# EAGLE design pbalduino (EAGLE 8.3.2)
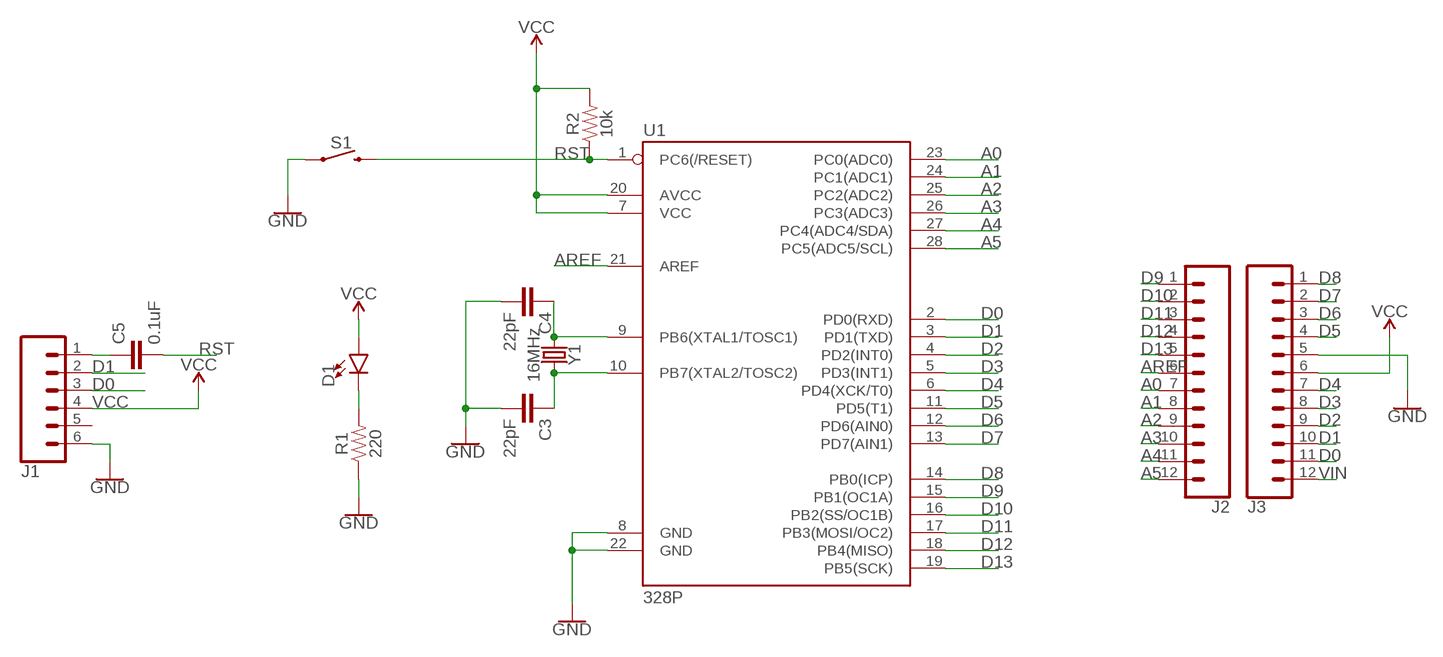
[diagram p0: schematic, sheet 1]

## Parts
C3  22pF  22PF-PTH-2.54MM-200V-5%  [CAP-PTH-2.54]
C4  22pF  22PF-PTH-2.54MM-200V-5%  [CAP-PTH-2.54]
C5  0.1uF  0.1UF-KIT-EZ-50V-20%  [CAP-PTH-SMALL-KIT]
D1  LED-3MM-NO_SILK  [LED_3MM-NS]
J1  CONN_06LOCK  [1X06_LOCK]
J2  CONN_12  [1X12]
J3  CONN_12  [1X12]
R1  220  1KOHM-VERT-1/4W-5%  [AXIAL-0.1]
R2  10k  1KOHM-VERT-1/4W-5%  [AXIAL-0.1]
S1  MOMENTARY-SWITCH-SPST-PTH-6.0MM  [TACTILE_SWITCH_PTH_6.0MM]
U1  328P  ATMEGA328P_PDIP  [DIP28]
Y1  16MHz  CRYSTAL-16MHZPTH-HC49US  [HC49US]

## Nets
A0: J2.7 U1.23(PC0(ADC0))
A1: J2.8 U1.24(PC1(ADC1))
A2: J2.9 U1.25(PC2(ADC2))
A3: J2.10 U1.26(PC3(ADC3))
A4: J2.11 U1.27(PC4(ADC4/SDA))
A5: J2.12 U1.28(PC5(ADC5/SCL))
AREF: J2.6 U1.21(AREF)
D0: J1.3 J3.11 U1.2(PD0(RXD))
D1: J1.2 J3.10 U1.3(PD1(TXD))
D2: J3.9 U1.4(PD2(INT0))
D3: J3.8 U1.5(PD3(INT1))
D4: J3.7 U1.6(PD4(XCK/T0))
D5: J3.4 U1.11(PD5(T1))
D6: J3.3 U1.12(PD6(AIN0))
D7: J3.2 U1.13(PD7(AIN1))
D8: J3.1 U1.14(PB0(ICP))
D9: J2.1 U1.15(PB1(OC1A))
D10: J2.2 U1.16(PB2(SS/OC1B))
D11: J2.3 U1.17(PB3(MOSI/OC2))
D12: J2.4 U1.18(PB4(MISO))
D13: J2.5 U1.19(PB5(SCK))
GND: C3.2 C4.2 J1.6 J3.5 R1.P$1 S1.1 U1.8(GND) U1.22(GND)
N$1: C5.1 J1.1
N$21: C3.1 U1.10(PB7(XTAL2/TOSC2)) Y1.2
N$22: C4.1 U1.9(PB6(XTAL1/TOSC1)) Y1.1
N$28: D1.K(C) R1.P$2
RST: C5.2 R2.P$1 S1.3 U1.1(PC6(/RESET))
VCC: D1.A J1.4 J3.6 R2.P$2 U1.7(VCC) U1.20(AVCC)
VIN: J3.12
Unconnected: J1.5

## Library data of the parts
C3 C4 = SparkFun-Capacitors:22PF: 22pF ceramic capacitors A capacitor is a passive two-terminal electrical component used to store electrical energy temporarily in an electric field.; PROD_ID: CAP-09128
C5 = SparkFun-Capacitors:0.1UF: 0.1µF ceramic capacitors A capacitor is a passive two-terminal electrical component used to store electrical energy temporarily in an electric field.; PROD_ID: CAP-08370
D1 = SparkFun-LED:LED: LED (Generic) Standard schematic elements and footprints for 5mm, 3mm, 1206, and 0603 sized LEDs. Generic LEDs with no color specified.
J1 = SparkFun-Connectors:CONN_06: Multi connection point. Often used as Generic Header-pin footprint for 0.1 inch spaced/style header connections On any of the 0.1 inch spaced packages, you can populate with these: Break Away Headers - Straight <https://www.sparkfun.com/products/116> (PRT-00116) Break Away Male Headers - Right Angle <https://www.sparkfun.com/products/553> (PRT-00553) Female Headers <https://www.sparkfun.com/products/115> (PRT-00115) Break Away Headers - Machine Pin <https://www.sparkfun.com/products/117> (PRT-00117) Break Away Female Headers - Swiss Machine Pin <https://www.sparkfun.com/products/743> (PRT-00743) Arduino Stackable Header - 6 Pin <https://www.sparkfun.com/products/9280> (PRT-09280) For SCREWTERMINALS and SPRING TERMINALS visit here: Screw Terimnals on SparkFun.com <https://www.sparkfun.com/search/results?term=Screw+Terminals> (5mm/3.5mm/2.54mm spacing) This device is also useful as a general connection point to wire up your design to another part of your project. Our various solder wires solder well into these plated through hole pads. Hook-Up Wire - Assortment (Stranded, 22 AWG) <https://www.sparkfun.com/products/11375> (PRT-11375) Hook-Up Wire - Assortment (Solid Core, 22 AWG) <https://www.sparkfun.com/products/11367> (PRT-11367) View the entire wire category on our website here <https://www.sparkfun.com/categories/141>
J2 J3 = SparkFun-Connectors:CONN_12: Multi connection point. Often used as Generic Header-pin footprint for 0.1 inch spaced/style header connections On any of the 0.1 inch spaced packages, you can populate with these: Break Away Headers - Straight <https://www.sparkfun.com/products/116> (PRT-00116) Break Away Male Headers - Right Angle <https://www.sparkfun.com/products/553> (PRT-00553) Female Headers <https://www.sparkfun.com/products/115> (PRT-00115) Break Away Headers - Machine Pin <https://www.sparkfun.com/products/117> (PRT-00117) Break Away Female Headers - Swiss Machine Pin <https://www.sparkfun.com/products/743> (PRT-00743) For SCREWTERMINALS and SPRING TERMINALS visit here: Screw Terimnals on SparkFun.com <https://www.sparkfun.com/search/results?term=Screw+Terminals> (5mm/3.5mm/2.54mm spacing) This device is also useful as a general connection point to wire up your design to another part of your project. Our various solder wires solder well into these plated through hole pads. Hook-Up Wire - Assortment (Stranded, 22 AWG) <https://www.sparkfun.com/products/11375> (PRT-11375) Hook-Up Wire - Assortment (Solid Core, 22 AWG) <https://www.sparkfun.com/products/11367> (PRT-11367) View the entire wire category on our website here <https://www.sparkfun.com/categories/141> Special notes: Molex polarized connector foot print use with SKU : PRT-08231 with associated crimp pins and housings. 1MM SMD Version SKU: PRT-10208 NOTES ON THE VARIANTS LOCK and LOCK_LONGPADS... This footprint was designed to help hold the alignment of a through-hole component (i.e. 6-pin header) while soldering it into place. You may notice that each hole has been shifted either up or down by 0.005 of an inch from it's more standard position (which is a perfectly straight line). This slight alteration caused the pins (the squares in the middle) to touch the edges of the holes. Because they are alternating, it causes a "brace" to hold the component in place. 0.005 has proven to be the perfect amount of "off-center" position when using our standard breakaway headers. Although looks a little odd when you look at the bare footprint, once you have a header in there, the alteration is very hard to notice. Also,if you push a header all the way into place, it is covered up entirely on the bottom side.
R1 R2 = SparkFun-Resistors:1KOHM: 1kΩ resistor A resistor is a passive two-terminal electrical component that implements electrical resistance as a circuit element. Resistors act to reduce current flow, and, at the same time, act to lower voltage levels within circuits. - Wikipedia; PROD_ID: RES-08380; VALUE: 1k
S1 = SparkFun-Switches:MOMENTARY-SWITCH-SPST: Momentary Switch (Pushbutton) - SPST Normally-open (NO) SPST momentary switches (buttons, pushbuttons). Variants PTH-12MM - 12mm square, through-hole Momentary Pushbutton Switch - 12mm Square <https://www.sparkfun.com/products/9190> (COM-09190) PTH-6.0MM, PTH-6.0MM-KIT - 6.0mm square, through-hole Mini Pushbutton Switch <https://www.sparkfun.com/products/97> (COM-00097) KIT package intended for soldering kit's - only one side of pads' copper is exposed. PTH-RIGHT-ANGLE-KIT - Right-angle, through-hole Right Angle Tactile Button <https://www.sparkfun.com/products/10791> - Used on SparkFun BigTime Watch Kit <https://www.sparkfun.com/products/11734> SMD-12MM - 12mm square, surface-mount Tactile Button - SMD (12mm) <https://www.sparkfun.com/products/12993> (COM-12993) Used on SparkFun PicoBoard <https://www.sparkfun.com/products/11888> SMD-4.5MM - 4.5mm Square Trackball Switch Used on SparkFun Blackberry Trackballer Breakout <https://www.sparkfun.com/products/13169> SMD-4.6MMX2.8MM - 4.60mm x 2.80mm, surface mount Used on SparkFun SAMD21 Mini Breakout <https://www.sparkfun.com/products/13664> SMD-5.2MM, SMD-5.2-REDUNDANT - 5.2mm square, surface-mount Mini Pushbutton Switch - SMD <https://www.sparkfun.com/products/8720> (COM-08720) Used on Arduino Pro Mini <https://www.sparkfun.com/products/11114> REDUNDANT package connects both switch circuits together SMD-6.0X3.5MM - 6.0 x 3.5mm, surface mount Momentary Reset Switch SMD <https://www.sparkfun.com/products/8229> (COM-08229) SMD-6.2MM-TALL - 6.2mm square, surface mount Tactile Button - SMD (6mm) <https://www.sparkfun.com/products/12992> Used on SparkFun Digital Sandbox <https://www.sparkfun.com/products/12651> SMD-RIGHT-ANGLE - Right-angle, surface mount Used on SparkFun Block for Intel® Edison - Arduino <https://www.sparkfun.com/products/13036>; PROD_ID: SWCH-08441; SF_SKU: COM-00097
U1 = SparkFun-IC-Microcontroller:ATMEGA328P_PDIP: Atmel 328P Through hole ATMEGA328P uC used in the Arduino 32kb flash, 1k EEPROM, 2k SRAM Datasheet <http://www.sparkfun.com/datasheets/Components/SMD/ATMega328.pdf> SparkFun Products Storefront component: AVR 28 Pin 20MHz 32K 6A/D - ATMega328P <https://www.sparkfun.com/products/9061> (COM-09061) SparkFun Simon Says - Through-Hole Soldering Kit <https://www.sparkfun.com/products/10547> (KIT-10547) SparkFun Learn to Solder - Simon Says <https://www.sparkfun.com/products/13708> (KIT-13708) SparkFun BigTime Watch Kit <https://www.sparkfun.com/products/11734> (KIT-11734) SparkFun ClockIt <https://www.sparkfun.com/products/10930> (KIT-10930) SparkFun Serial Enabled LCD Kit <https://www.sparkfun.com/products/10097> (LCD-10097) SparkFun Simon Tilts - Through Hole Soldering Kit <https://www.sparkfun.com/products/12634> (KIT-12634) SparkFun Frequency Counter Kit <https://www.sparkfun.com/products/10140> (KIT-10140) FabFM Radio Kit <https://www.sparkfun.com/products/11043> (KIT-11043) SparkFun Binary Blaster Kit <https://www.sparkfun.com/products/12037> (KIT-12037) SparkFun Metro-Gnome <https://www.sparkfun.com/products/9236> (KIT-09236) ATmega328 with Arduino Optiboot (Uno) <https://www.sparkfun.com/products/10524> (DEV-10524); PROD_ID: IC-09136
Y1 = SparkFun-Clocks:CRYSTAL-16MHZ: 16MHz Crystal Digikey Example <http://www.digikey.com/product-search/en?keywords=535-9122-1-ND> Frequency: 16MHz Frequency Stability: ±50ppm Frequency Tolerance: ±20ppm Load Capacitance: 18pF SparkFun Products: Pro Micro -5V/16MHz <https://www.sparkfun.com/products/12640> SparkFun Serial Enabled LCD Kit <https://www.sparkfun.com/products/10097>; PROD_ID: XTAL-08181; SF_ID: COM-00536

## Board
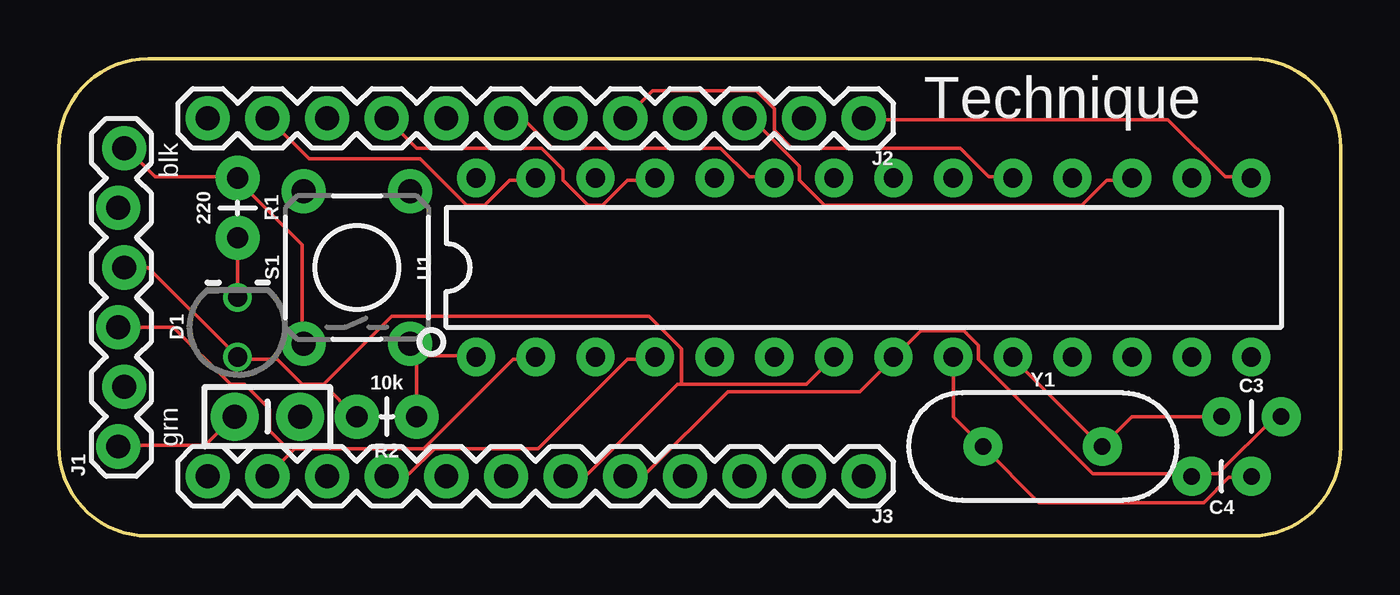
[diagram p1: board, top side]
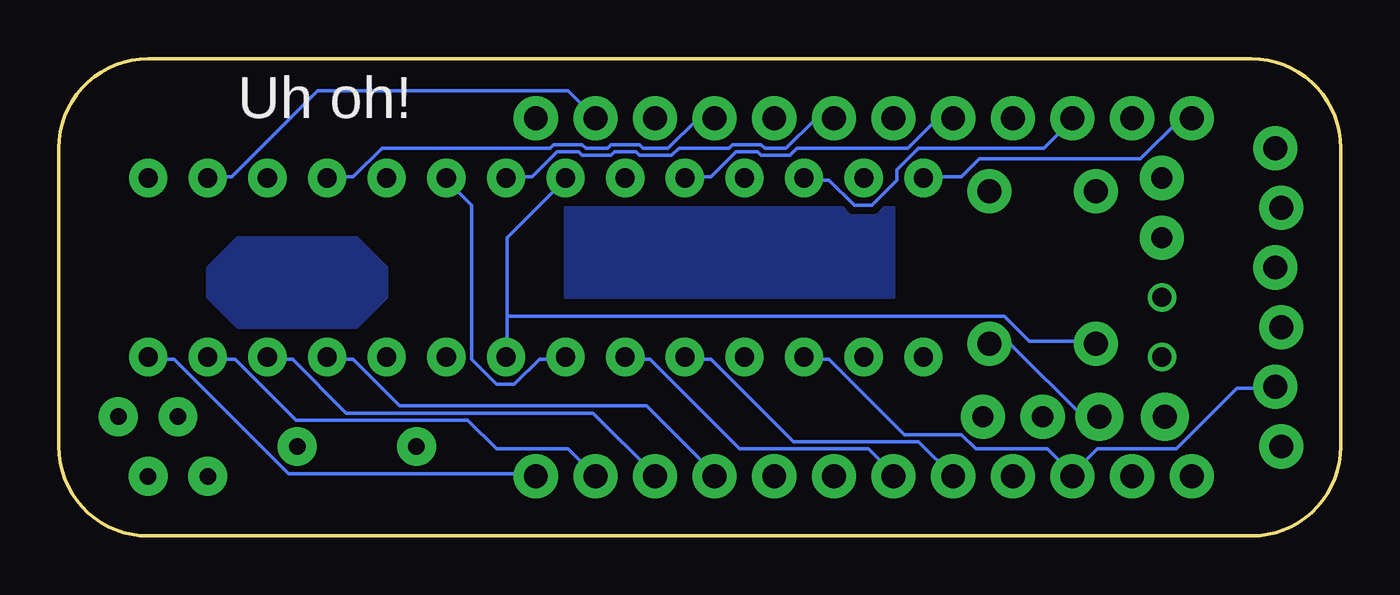
[diagram p2: board, bottom side, seen from below]

Size 54.61 x 20.32 mm. Coordinates in mm from the lower left corner, seen from the top.
Outline: 0,3.81 0,16.51 arc-90 3.81,20.32 50.8,20.32 arc-90 54.61,16.51 54.61,3.81 arc-90 50.8,0 3.81,0 arc-90 0,3.81
Copper layers (1*16): Top 0.0356mm / dielectric 1.5011mm / Bottom 0.0356mm
Design rules "oshpark-2layer": minimum track width 6mil, minimum drill 13mil, track to track 6mil, track to pad 6mil, pad to pad 6mil, via to via 6mil, smd to smd 6mil, copper to edge 15mil, drill to drill 6mil, minimum pad ring 7mil, minimum via ring 7mil, stop-mask expansion 2.5mil, vias tented up to drill 0mil, thermal gap 10mil

### Footprints (pad centres in the part's own frame; a part is rotated, then mirrored left to right if it is on the bottom)
CAP-PTH-2.54 = drill 0.7 pad 1.651: 1 -1.27,0; 2 1.27,0
CAP-PTH-SMALL-KIT = drill 1.016 pad 2.032: 1 -1.397,0; 2 1.397,0
LED_3MM-NS = drill 0.813: A -1.27,0; K 1.27,0
1X06_LOCK = drill 1.016 pad 1.88: 1 0,0; 2 2.54,-0.254; 3 5.08,0; 4 7.62,-0.254; 5 10.16,0; 6 12.7,-0.254
1X12 = drill 1.016 pad 1.88: 1 0,0; 2 2.54,0; 3 5.08,0; 4 7.62,0; 5 10.16,0; 6 12.7,0; 7 15.24,0; 8 17.78,0; 9 20.32,0; 10 22.86,0; 11 25.4,0; 12 27.94,0
AXIAL-0.1 = drill 0.9 pad 1.88: P$1 -1.27,0; P$2 1.27,0
TACTILE_SWITCH_PTH_6.0MM = drill 1.016 pad 1.88: 1 -3.251,2.261; 2 3.251,2.261; 3 -3.251,-2.261; 4 3.251,-2.261
DIP28 = drill 0.813 pad 1.626: 1 -16.51,-3.81; 2 -13.97,-3.81; 3 -11.43,-3.81; 4 -8.89,-3.81; 5 -6.35,-3.81; 6 -3.81,-3.81; 7 -1.27,-3.81; 8 1.27,-3.81; 9 3.81,-3.81; 10 6.35,-3.81; 11 8.89,-3.81; 12 11.43,-3.81; 13 13.97,-3.81; 14 16.51,-3.81; 15 16.51,3.81; 16 13.97,3.81; 17 11.43,3.81; 18 8.89,3.81; 19 6.35,3.81; 20 3.81,3.81; 21 1.27,3.81; 22 -1.27,3.81; 23 -3.81,3.81; 24 -6.35,3.81; 25 -8.89,3.81; 26 -11.43,3.81; 27 -13.97,3.81; 28 -16.51,3.81
HC49US = drill 0.7 pad 1.651: 1 -2.54,0; 2 2.54,0

### Placement (x,y rotation side)
C3  50.8,5.08 0 top
C4  49.53,2.54 180 top
C5  8.89,5.08 0 top
D1  7.62,8.89 90 top
J1  2.54,3.81 90 top
J2  34.29,17.78 180 top
J3  34.29,2.54 180 top
R1  7.62,13.97 270 top
R2  13.97,5.08 180 top
S1  12.7,11.43 90 top
U1  34.29,11.43 0 top
Y1  41.91,3.81 0 top

### Tracks (layer width: path | path; a pad name or v marks a point on that pad's centre or on a via)
A0
  Top 0.152: U1.23 30.48,15.29 29.41,15.29 28.19,16.51 21.03,16.51 19.81,17.73 19.05,17.73 J2.7
A1
  Bottom 0.152: U1.24 27.89,15.29 26.82,15.29 25.76,16.36 24.84,16.36 24.69,16.21 23.47,16.21 23.16,16.51 18.44,16.51 17.22,17.73 16.61,17.73 J2.8
A2
  Top 0.152: J2.9 15.24,16.51 20.57,16.51 21.49,15.6 21.49,15.14 22.55,14.07 23.16,14.07 24.23,15.14 25.3,15.14 U1.25
A3
  Bottom 0.152: U1.26 22.86,15.14 21.79,15.14 20.73,14.07 19.96,14.07 18.9,15.14 18.9,15.6 17.98,16.51 12.65,16.51 11.43,17.73 J2.10
A4
  Top 0.152: U1.27 20.27,15.14 19.2,15.14 18.14,14.07 17.37,14.07 15.39,16.05 10.67,16.05 8.99,17.73 J2.11
A5
  Bottom 0.152: U1.28 17.68,15.29 16.15,15.29 15.39,16.05 8.53,16.05 6.86,17.73 6.4,17.73 J2.12
AREF
  Bottom 0.152: U1.21 35.51,15.29 34.44,15.29 33.38,16.36 32.46,16.36 32.31,16.21 31.09,16.21 30.94,16.36 30.02,16.36 29.87,16.21 28.5,16.21 28.19,16.51 26.06,16.51 25.91,16.66 24.69,16.66 24.54,16.51 23.62,16.51 22.4,17.73 21.64,17.73 J2.6
D0
  Top 0.152: J3.11 9.91,3.56 | 9.91,3.56 10.06,3.71 15.54,3.71 19.35,7.52 20.27,7.52 U1.2 | J1.3 4.88,8.89 7.31,6.45 7.92,6.45 8.99,5.38 8.99,4.47 9.91,3.56
D1
  Bottom 0.152: 11.43,2.64 12.5,3.71 15.54,3.71 16.15,4.32 18.59,4.32 21.79,7.52 22.86,7.52 U1.3 | 11.43,2.64 10.36,3.71 7.01,3.71 4.42,6.3 2.9,6.3 J1.2 | 11.43,2.64 J3.10
D2
  Top 0.152: U1.4 25.3,7.52 24.23,7.52 20.42,3.71 16,3.71 14.94,2.64 14.02,2.64 J3.9
D3
  Bottom 0.152: J3.8 17.98,4.01 23.32,4.01 26.82,7.52 27.89,7.52 U1.5
D4
  Bottom 0.152: U1.6 30.48,7.52 29.41,7.52 25.6,3.71 20.12,3.71 19.05,2.64 J3.7
D5
  Bottom 0.152: U1.11 43.13,7.52 42.06,7.52 40.08,5.54 29.57,5.54 26.67,2.64 J3.4
D6
  Bottom 0.152: U1.12 45.72,7.52 44.65,7.52 42.37,5.23 31.85,5.23 29.26,2.64 J3.3
D7
  Bottom 0.152: J3.2 32.92,3.71 35.97,3.71 37.19,4.93 44.5,4.93 47.09,7.52 48.16,7.52 U1.13
D8
  Bottom 0.152: U1.14 50.75,7.52 49.68,7.52 44.81,2.64 34.29,2.64 J3.1
D9
  Top 0.152: U1.15 50.75,15.29 49.68,15.29 47.24,17.73 34.29,17.73 J2.1
D10
  Bottom 0.152: J2.2 32.92,18.95 43.59,18.95 47.24,15.29 48.16,15.29 U1.16
D11
  Top 0.152: U1.17 45.72,15.14 44.65,15.14 43.59,14.07 32.61,14.07 31.55,15.14 31.55,15.75 29.57,17.73 29.26,17.73 J2.3
D12
  Bottom 0.152: U1.18 43.13,15.29 42.06,15.29 40.84,16.51 33.68,16.51 33.53,16.66 32.31,16.66 32.16,16.51 31.24,16.51 31.09,16.66 29.87,16.66 29.72,16.51 28.65,16.51 27.43,17.73 26.67,17.73 J2.4
D13
  Top 0.152: J2.5 25.3,18.95 29.72,18.95 30.48,18.19 30.48,17.27 31.24,16.51 38.41,16.51 39.62,15.29 40.54,15.29 U1.19
GND
  Top 0.152: J1.6 2.9,16.51 4.12,15.29 7.62,15.29 R1.P$1 7.62,15.14 10.36,12.39 10.36,8.28 S1.1 | C3.2 51.82,5.08 49.38,2.64 48.31,2.64 C4.2 48.16,2.64 44.04,2.64 39.17,7.52 39.17,8.13 38.56,8.74 36.73,8.74 35.66,7.67 U1.8 35.51,7.52 34.14,6.15 28.5,6.15 24.99,2.64 24.23,2.64 J3.5
  Bottom 0.152: 35.51,9.35 35.51,12.7 33.07,15.14 U1.22 | 35.51,9.35 35.51,7.67 U1.8 | 35.51,9.35 14.33,9.35 13.26,8.28 10.52,8.28 S1.1
N$1
  Top 0.152: J1.1 2.59,3.86 6.25,3.86 7.47,5.08 C5.1
N$2
  pour Bottom (isolate 0.305): 19.05,13.97 19.05,10.16 33.02,10.16 33.02,13.97
N$3
  pour Bottom (isolate 0.305): 41.91,12.7 46.99,12.7 48.26,11.43 48.26,10.16 46.99,8.89 41.91,8.89 40.64,10.16 40.64,11.43
N$21
  Top 0.152: U1.10 40.69,7.52 44.35,3.86 Y1.2 45.72,5.08 C3.1
N$22
  Top 0.152: U1.9 38.1,5.08 Y1.1 41.76,1.42 48.77,1.42 49.84,2.49 50.75,2.49 C4.1
N$28
  Top 0.152: R1.P$2 D1.K
RST
  Top 0.152: 15.54,7.67 17.68,7.67 U1.1 | 15.54,7.67 15.09,8.13 S1.3 15.54,7.67 | R2.P$1 15.24,7.37 15.54,7.67
  Bottom 0.152: C5.2 10.97,5.08 14.02,8.13 14.94,8.13 S1.3
VCC
  Top 0.152: 11.28,6.45 10.36,6.45 9.3,7.52 7.62,7.52 D1.A 3.81,11.43 J1.4 | 11.28,6.45 12.65,5.08 R2.P$2 | 26.52,6.45 31.85,6.45 U1.7 | 26.52,6.45 26.36,6.45 22.55,2.64 21.64,2.64 J3.6 | 11.28,6.45 14.17,9.35 25.15,9.35 26.52,7.98 26.52,6.45
  Bottom 0.152: U1.7 33.07,7.52 34.14,7.52 35.2,6.45 35.97,6.45 37.03,7.52 37.03,14.07 38.1,15.14 U1.20

### Text on the board
tPlace: Technique | blk | grn
bPlace: Uh oh!
bStop: Ronquillo | Paul